# EAGLE design 004 (EAGLE 9.6.2)

## Sheet 1 of 2
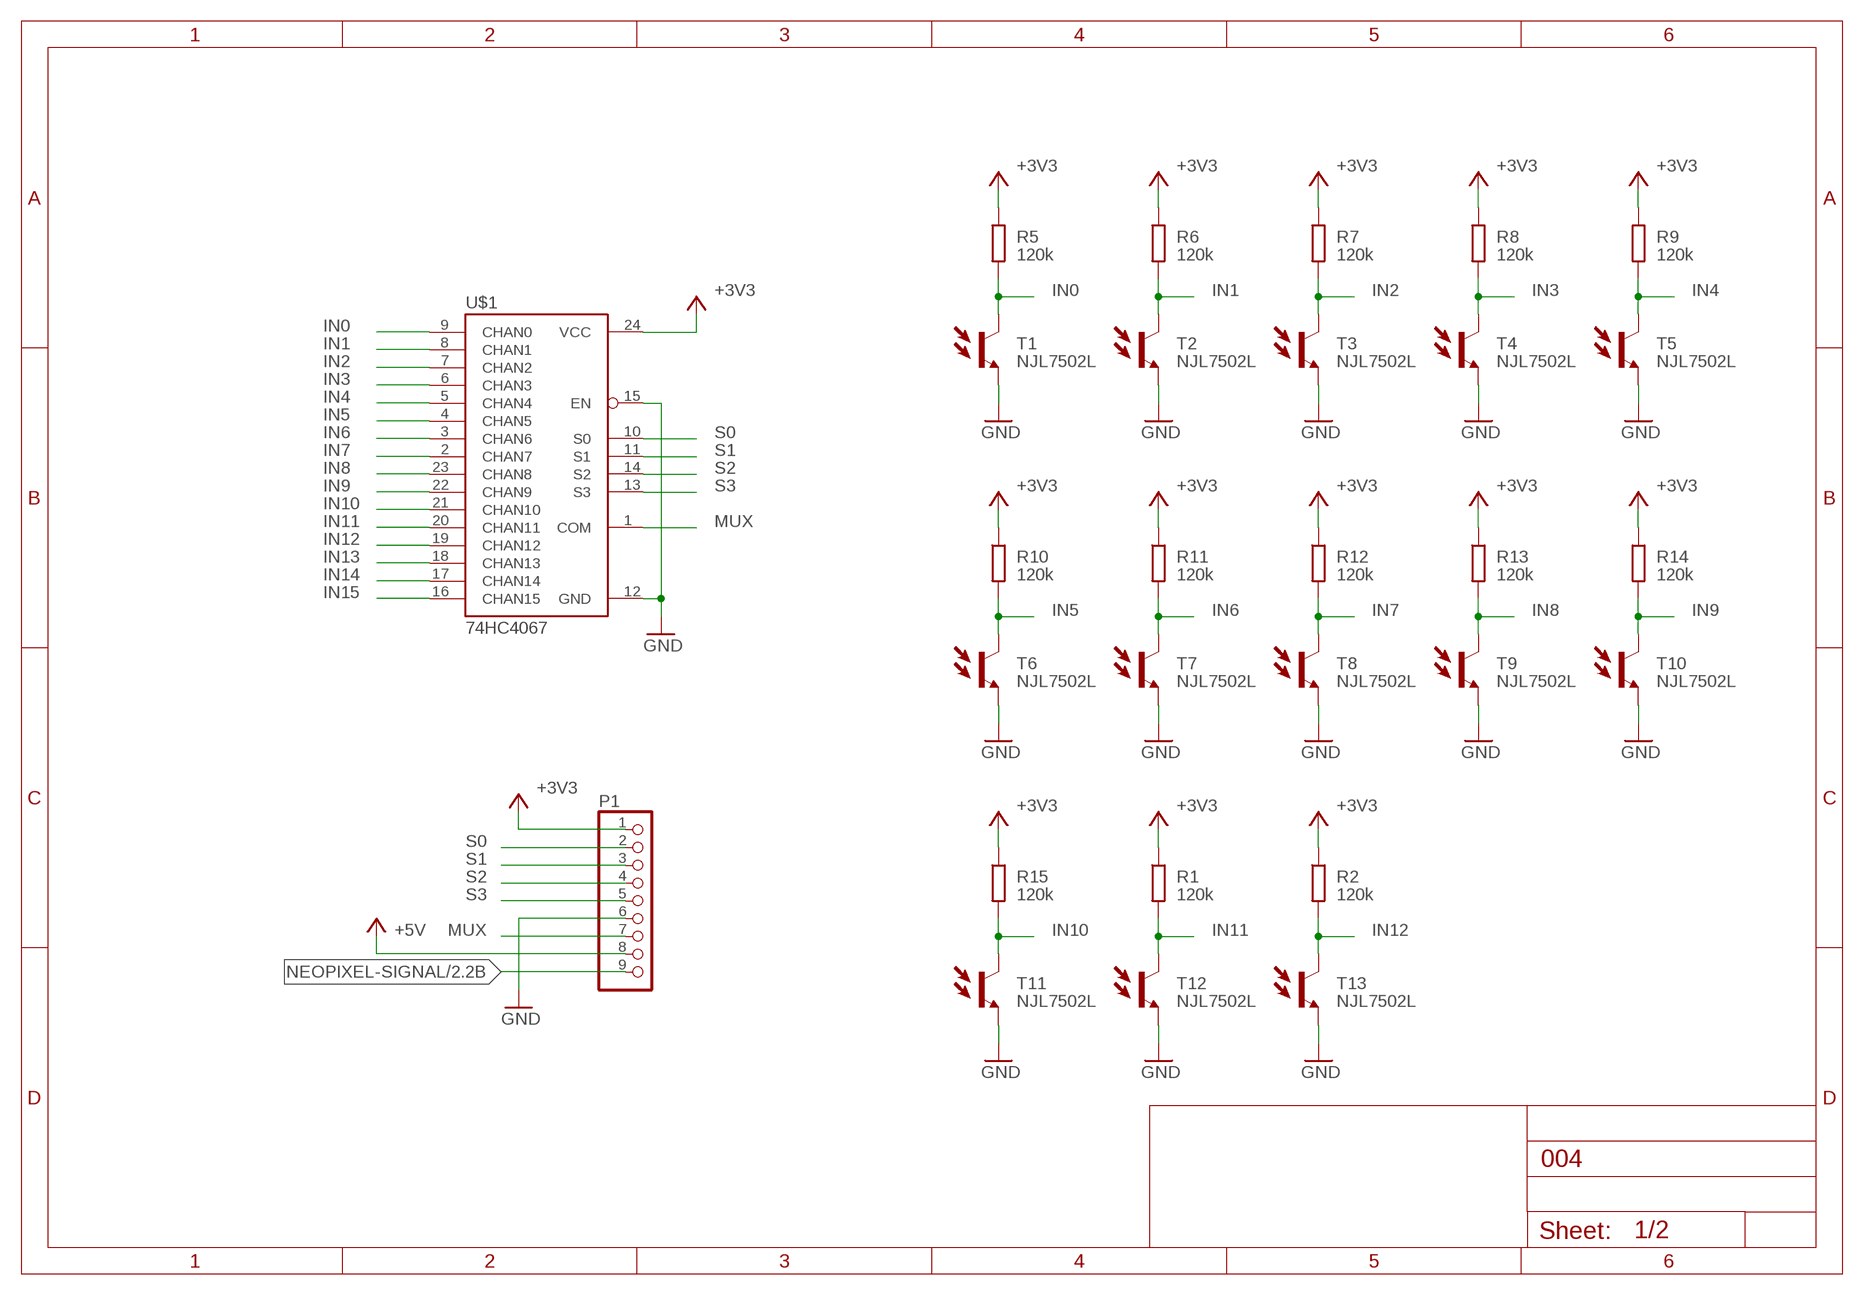
[diagram p0: schematic, sheet 1]

### Parts
P1  S9B-ZR-SM4A-TF  [ZH-SM4-SIDE09]
R1  120k  R-EU_R0805  [R0805]
R2  120k  R-EU_R0805  [R0805]
R5  120k  R-EU_R0805  [R0805]
R6  120k  R-EU_R0805  [R0805]
R7  120k  R-EU_R0805  [R0805]
R8  120k  R-EU_R0805  [R0805]
R9  120k  R-EU_R0805  [R0805]
R10  120k  R-EU_R0805  [R0805]
R11  120k  R-EU_R0805  [R0805]
R12  120k  R-EU_R0805  [R0805]
R13  120k  R-EU_R0805  [R0805]
R14  120k  R-EU_R0805  [R0805]
R15  120k  R-EU_R0805  [R0805]
T1  NJL7502L  MYPARTS_NJL7502L  [MYPARTS_NJL7502L]
T2  NJL7502L  MYPARTS_NJL7502L  [MYPARTS_NJL7502L]
T3  NJL7502L  MYPARTS_NJL7502L  [MYPARTS_NJL7502L]
T4  NJL7502L  MYPARTS_NJL7502L  [MYPARTS_NJL7502L]
T5  NJL7502L  MYPARTS_NJL7502L  [MYPARTS_NJL7502L]
T6  NJL7502L  MYPARTS_NJL7502L  [MYPARTS_NJL7502L]
T7  NJL7502L  MYPARTS_NJL7502L  [MYPARTS_NJL7502L]
T8  NJL7502L  MYPARTS_NJL7502L  [MYPARTS_NJL7502L]
T9  NJL7502L  MYPARTS_NJL7502L  [MYPARTS_NJL7502L]
T10  NJL7502L  MYPARTS_NJL7502L  [MYPARTS_NJL7502L]
T11  NJL7502L  MYPARTS_NJL7502L  [MYPARTS_NJL7502L]
T12  NJL7502L  MYPARTS_NJL7502L  [MYPARTS_NJL7502L]
T13  NJL7502L  MYPARTS_NJL7502L  [MYPARTS_NJL7502L]
U$1  74HC4067  SPARKFUN_MUX-74HC4067SMD  [SPARKFUN_SSOP24]

### Nets
+3V3: P1.1 R1.1 R2.1 R5.1 R6.1 R7.1 R8.1 R9.1 R10.1 R11.1 R12.1 R13.1 R14.1 R15.1 U$1.24(VCC)
+5V: P1.8 ; also sheet 2
GND: P1.6 T1.E T2.E T3.E T4.E T5.E T6.E T7.E T8.E T9.E T10.E T11.E T12.E T13.E U$1.12(GND) U$1.15(EN) ; also sheet 2
IN0: R5.2 T1.C U$1.9(CHAN0)
IN1: R6.2 T2.C U$1.8(CHAN1)
IN2: R7.2 T3.C U$1.7(CHAN2)
IN3: R8.2 T4.C U$1.6(CHAN3)
IN4: R9.2 T5.C U$1.5(CHAN4)
IN5: R10.2 T6.C U$1.4(CHAN5)
IN6: R11.2 T7.C U$1.3(CHAN6)
IN7: R12.2 T8.C U$1.2(CHAN7)
IN8: R13.2 T9.C U$1.23(CHAN8)
IN9: R14.2 T10.C U$1.22(CHAN9)
IN10: R15.2 T11.C U$1.21(CHAN10)
IN11: R1.2 T12.C U$1.20(CHAN11)
IN12: R2.2 T13.C U$1.19(CHAN12)
IN13: U$1.18(CHAN13)
IN14: U$1.17(CHAN14)
IN15: U$1.16(CHAN15)
MUX: P1.7 U$1.1(COM)
NEOPIXEL-SIGNAL: P1.9 ; also sheet 2
S0: P1.2 U$1.10(S0)
S1: P1.3 U$1.11(S1)
S2: P1.4 U$1.14(S2)
S3: P1.5 U$1.13(S3)

## Sheet 2 of 2: NeoPixels
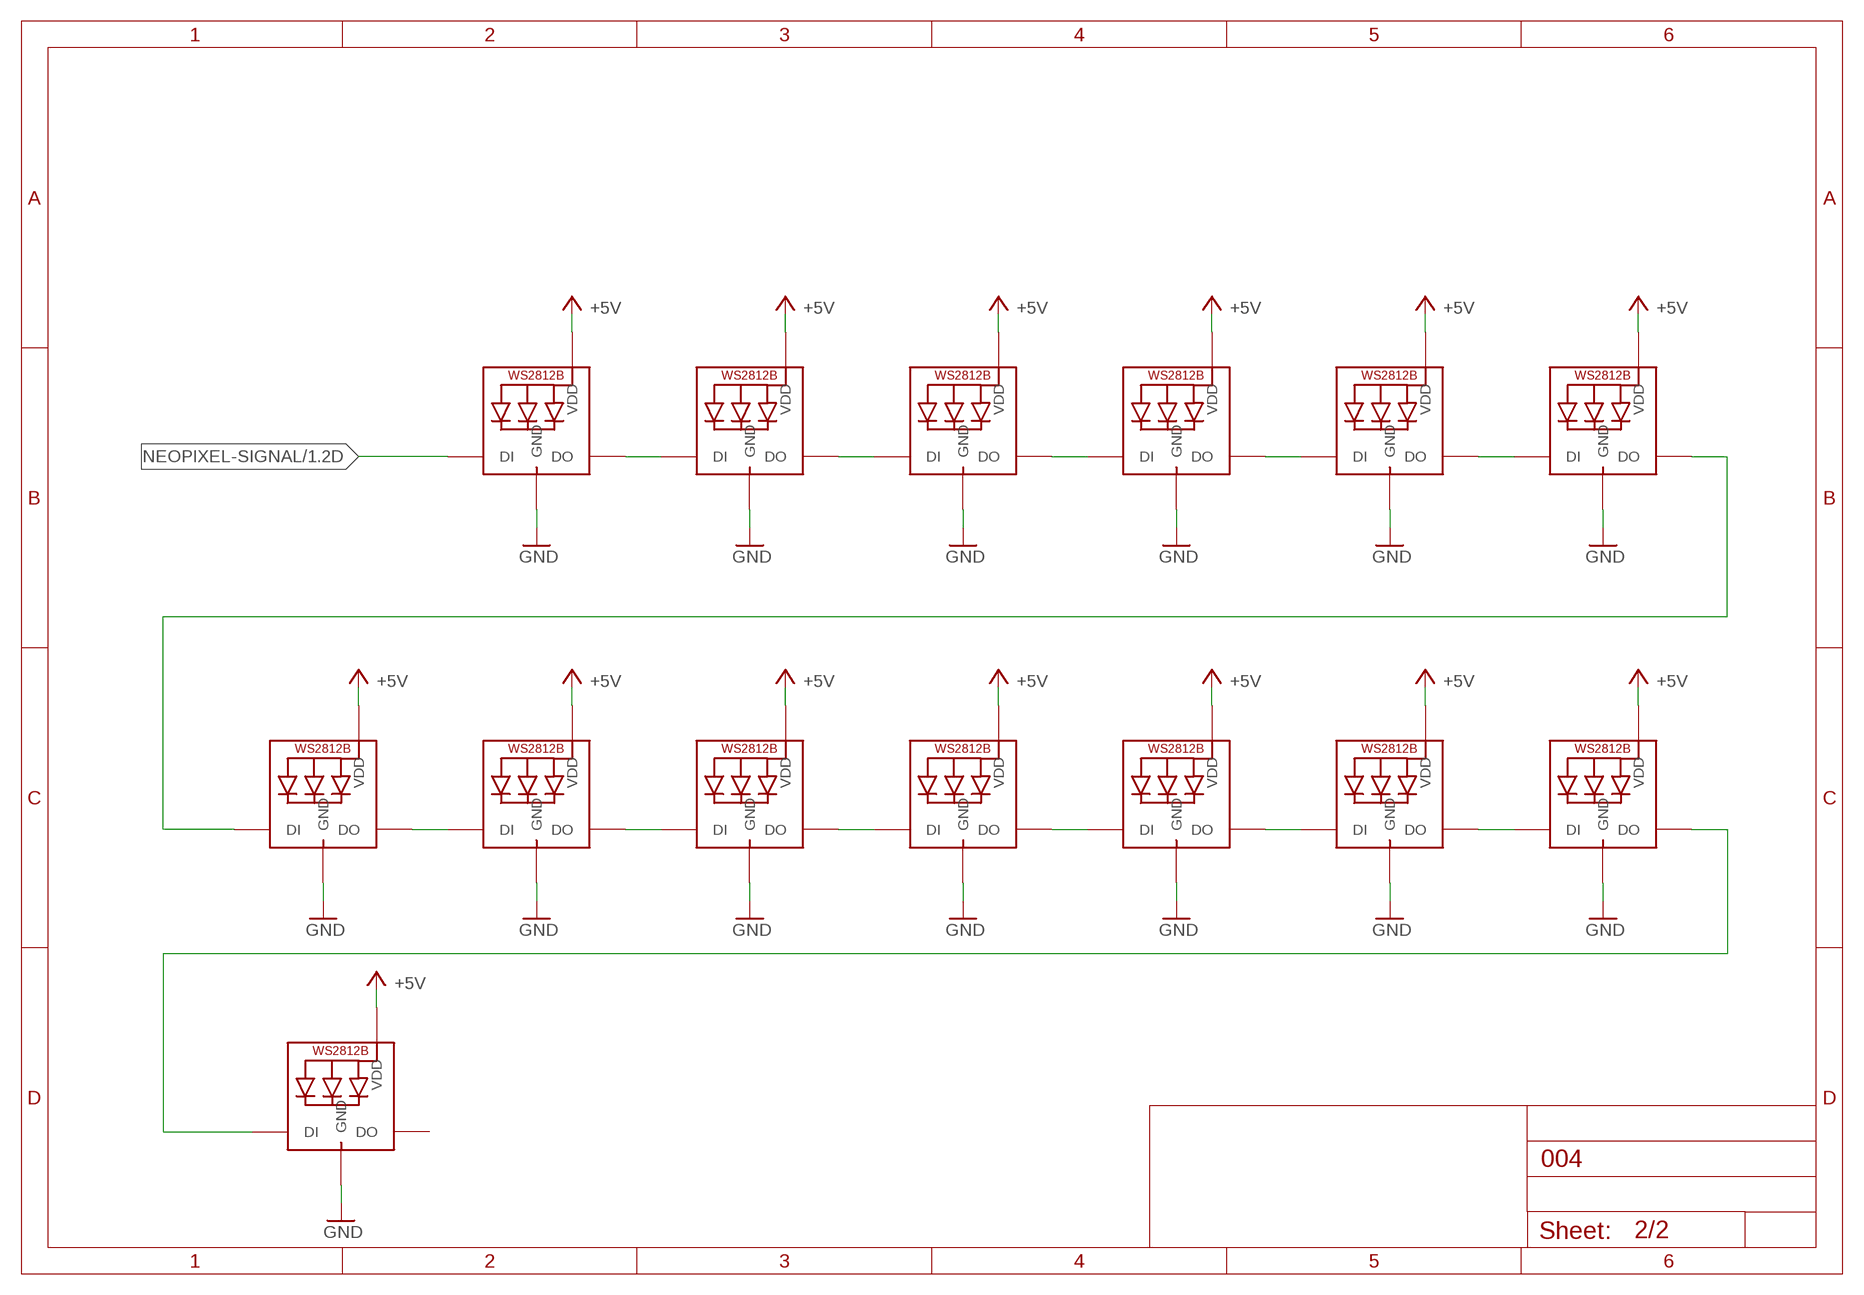
[diagram p1: schematic, sheet 2]

### Parts
LED1  WS2812B5050  [WS2812B]
LED2  WS2812B5050  [WS2812B]
LED3  WS2812B5050  [WS2812B]
LED4  WS2812B5050  [WS2812B]
LED5  WS2812B5050  [WS2812B]
LED6  WS2812B5050  [WS2812B]
LED7  WS2812B5050  [WS2812B]
LED8  WS2812B5050  [WS2812B]
LED9  WS2812B5050  [WS2812B]
LED10  WS2812B5050  [WS2812B]
LED11  WS2812B5050  [WS2812B]
LED12  WS2812B5050  [WS2812B]
LED13  WS2812B5050  [WS2812B]
LED14  WS2812B5050  [WS2812B]

### Nets
+5V: LED1.1-VDD(VDD) LED2.1-VDD(VDD) LED3.1-VDD(VDD) LED4.1-VDD(VDD) LED5.1-VDD(VDD) LED6.1-VDD(VDD) LED7.1-VDD(VDD) LED8.1-VDD(VDD) LED9.1-VDD(VDD) LED10.1-VDD(VDD) LED11.1-VDD(VDD) LED12.1-VDD(VDD) LED13.1-VDD(VDD) LED14.1-VDD(VDD) ; also sheet 1
GND: LED1.3-GND(GND) LED2.3-GND(GND) LED3.3-GND(GND) LED4.3-GND(GND) LED5.3-GND(GND) LED6.3-GND(GND) LED7.3-GND(GND) LED8.3-GND(GND) LED9.3-GND(GND) LED10.3-GND(GND) LED11.3-GND(GND) LED12.3-GND(GND) LED13.3-GND(GND) LED14.3-GND(GND) ; also sheet 1
N$1: LED2.2-DOUT(DO) LED3.4-DIN(DI)
N$2: LED1.2-DOUT(DO) LED2.4-DIN(DI)
N$3: LED3.2-DOUT(DO) LED4.4-DIN(DI)
N$4: LED4.2-DOUT(DO) LED5.4-DIN(DI)
N$5: LED5.2-DOUT(DO) LED6.4-DIN(DI)
N$6: LED6.2-DOUT(DO) LED7.4-DIN(DI)
N$7: LED7.2-DOUT(DO) LED8.4-DIN(DI)
N$8: LED8.2-DOUT(DO) LED9.4-DIN(DI)
N$9: LED9.2-DOUT(DO) LED10.4-DIN(DI)
N$10: LED10.2-DOUT(DO) LED11.4-DIN(DI)
N$11: LED11.2-DOUT(DO) LED12.4-DIN(DI)
N$12: LED12.2-DOUT(DO) LED13.4-DIN(DI)
N$13: LED13.2-DOUT(DO) LED14.4-DIN(DI)
NEOPIXEL-SIGNAL: LED1.4-DIN(DI) ; also sheet 1
Unconnected: LED14.2-DOUT(DO)

## Library data of the parts
LED1-LED14 = microbuilder:WS2812B
P1 = zh:S9B-ZR-SM4A-TF
R1 R2 R5-R15 = rcl:R-EU_: RESISTOR, European symbol; SPICEPREFIX: R
T1-T13 = #001-line:MYPARTS_NJL7502L
U$1 = Analog-Digital-Mux-Breakout:SPARKFUN_MUX-74HC4067

## Net classes
0 default: width 0.178 mm

## Board
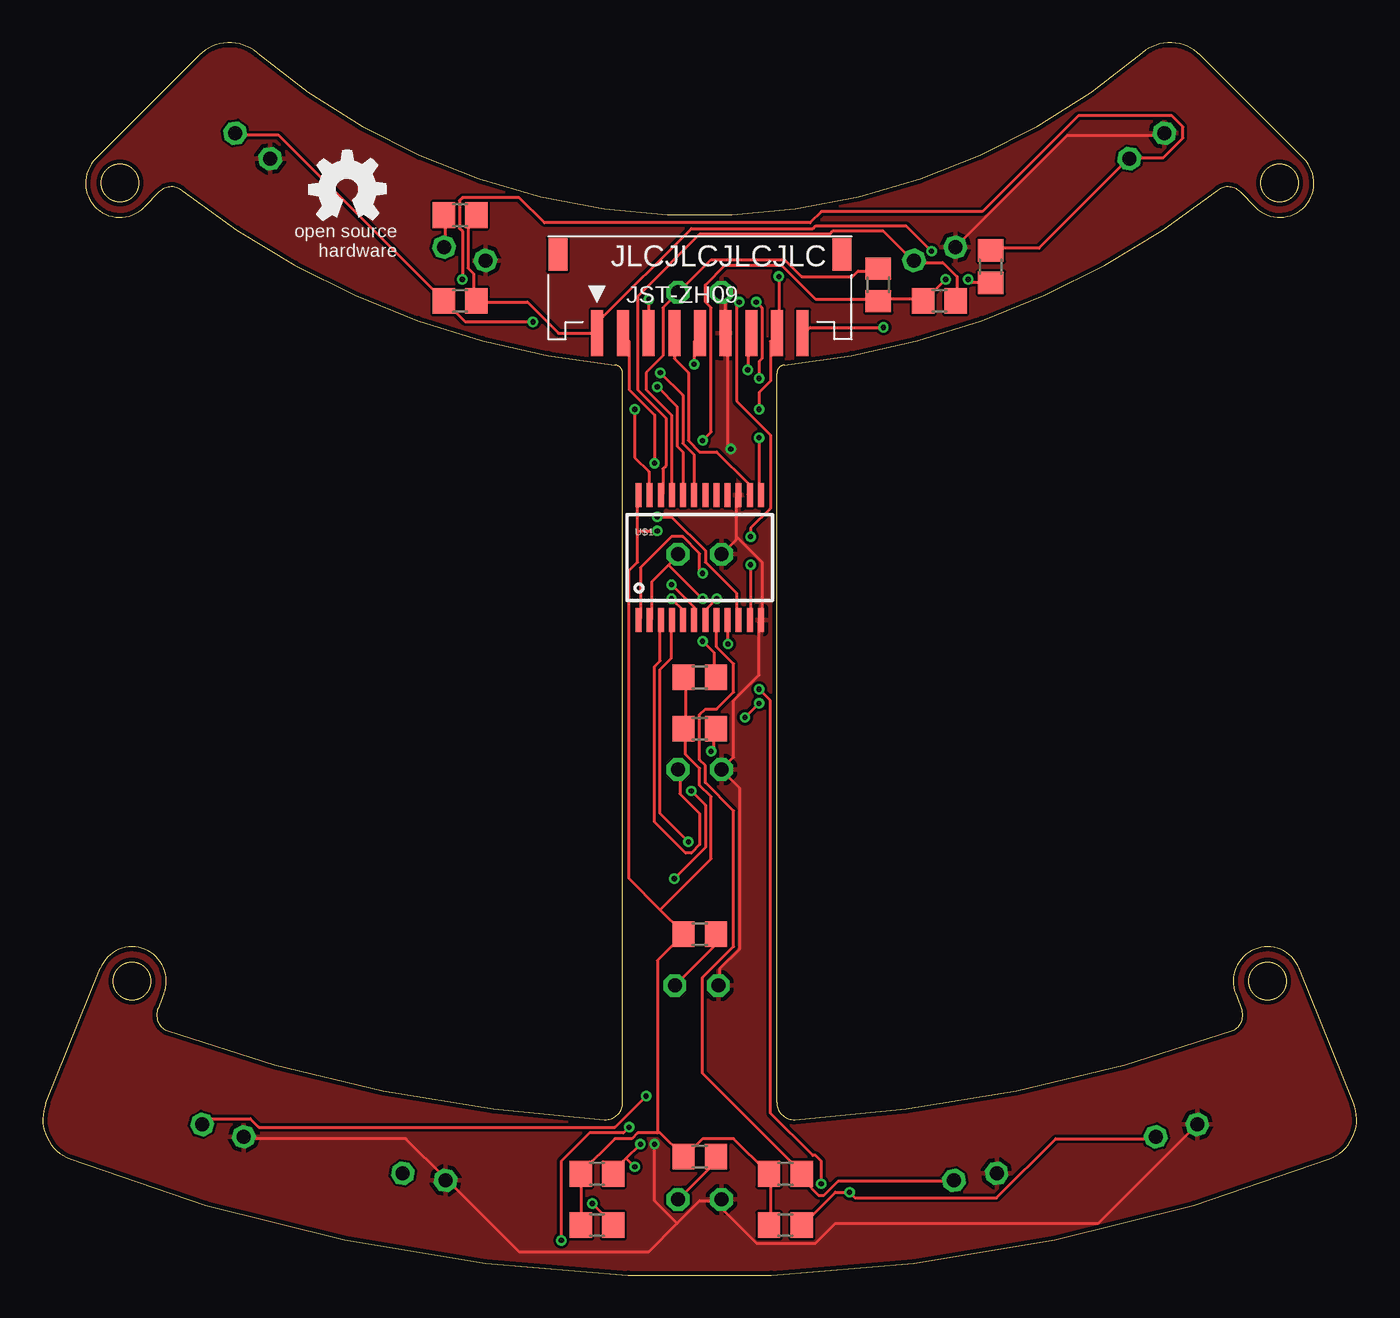
[diagram p2: board, top side]
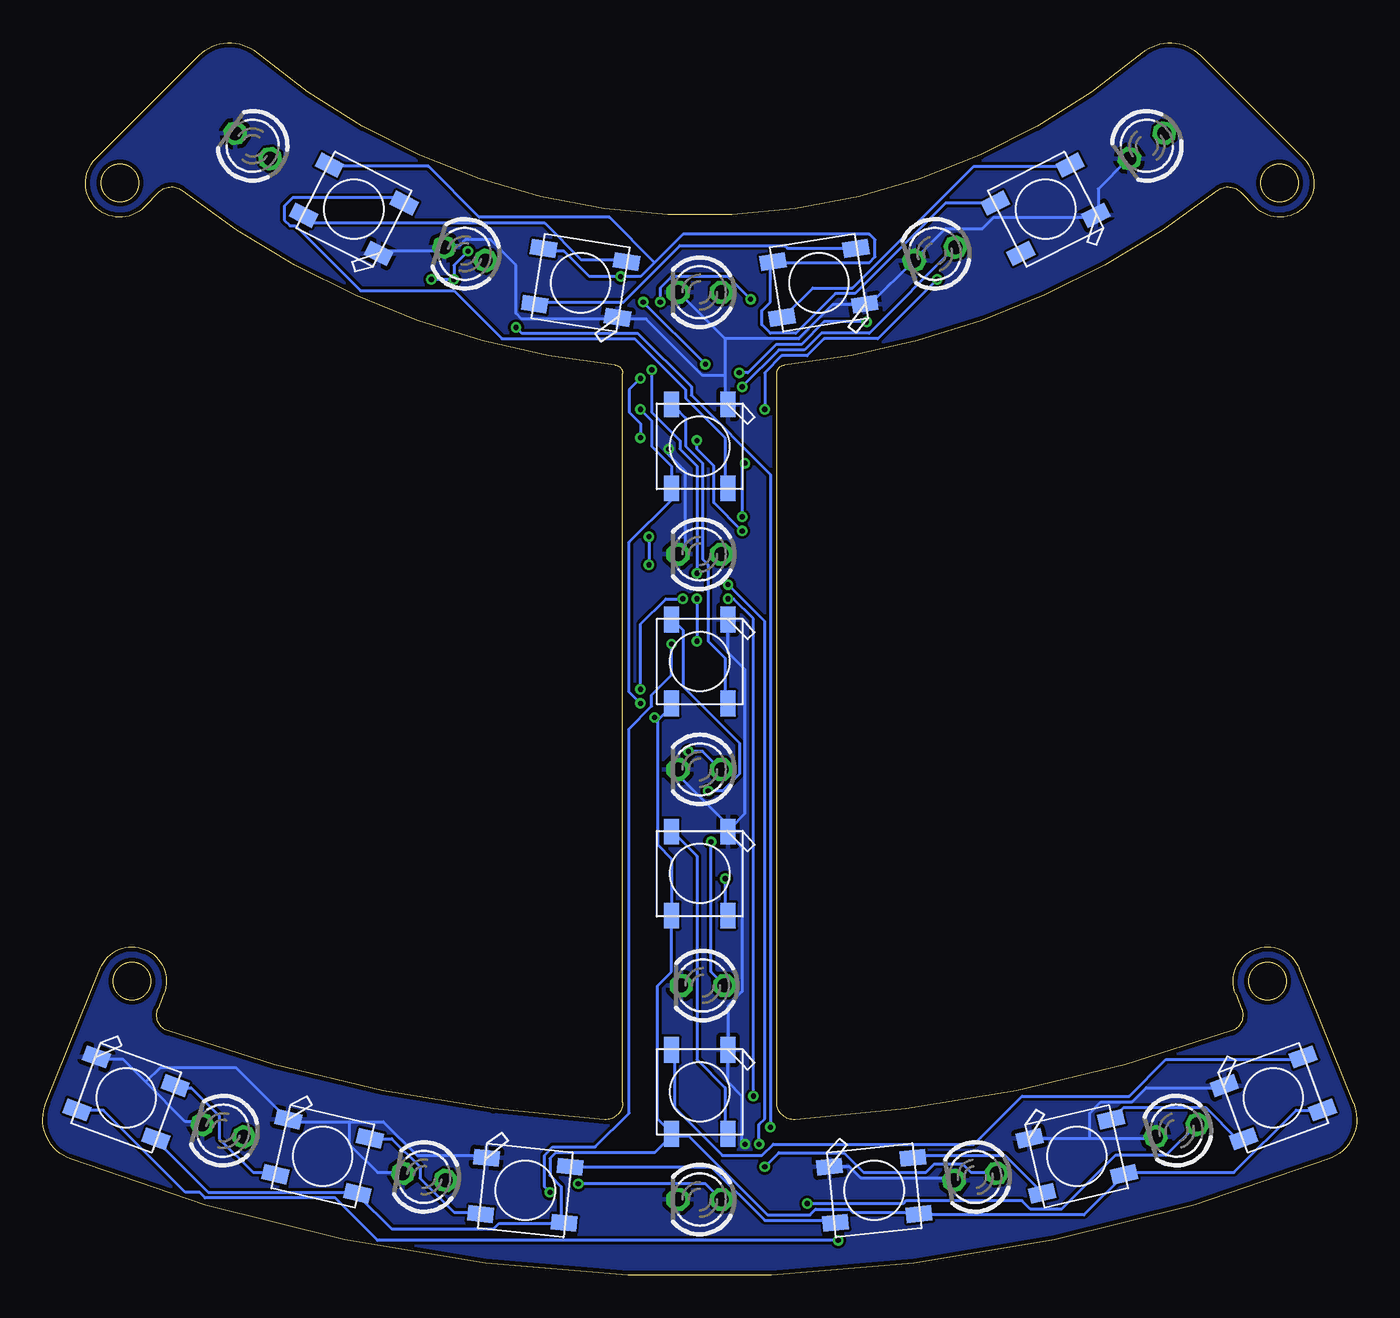
[diagram p3: board, bottom side, seen from below]

Size 76.76 x 71.99 mm. Coordinates in mm from the lower left corner, seen from the top.
Outline: 12.52,71.4 arc81 64.24,71.4
Outline: 12.52,71.4 arc85 9.14,71.26
Outline: 3.09,65.21 arc180 5.91,62.38
Outline: 8.14,63.36 arc83 6.81,63.28
Outline: 8.14,63.36 arc32 33.43,53.17
Outline: 33.88,52.67 arc84 33.43,53.17
Outline: 32.82,9.08 arc93 33.88,10.08
Outline: 7.32,14.25 arc16 32.82,9.08
Outline: 6.73,15.57 arc92 7.32,14.25
Outline: 7.07,16.42 arc180 3.36,17.92
Outline: 0.18,10.04 arc91 1.6,6.78
Outline: 1.6,6.78 arc42 75.16,6.78
Outline: 75.16,6.78 arc91 76.57,10.04
Outline: 73.39,17.92 arc180 69.68,16.42
Outline: 69.43,14.25 arc92 70.03,15.57
Outline: 43.94,9.08 arc16 69.43,14.25
Outline: 42.88,10.08 arc93 43.94,9.08
Outline: 43.33,53.17 arc84 42.88,52.67
Outline: 43.33,53.17 arc32 68.62,63.36
Outline: 69.94,63.28 arc83 68.62,63.36
Outline: 70.84,62.38 arc180 73.67,65.21
Outline: 67.62,71.26 arc85 64.24,71.4
Outline: 67.62,71.26 arc85 64.24,71.4
Outline: 73.67,65.21 67.62,71.26
Outline: 43.33,53.17 arc32 68.62,63.36
Outline: 43.33,53.17 arc84 42.88,52.67
Outline: 42.88,10.08 42.88,52.67
Outline: 76.57,10.04 73.39,17.92
Outline: 75.16,6.78 arc91 76.57,10.04
Outline: 73.39,17.92 arc180 69.68,16.42
Outline: 70.84,62.38 arc180 73.67,65.21
Outline: 69.94,63.28 70.84,62.38
Outline: 69.94,63.28 arc83 68.62,63.36
Outline: 43.94,9.08 arc16 69.43,14.25
Outline: 42.88,10.08 arc93 43.94,9.08
Outline: 69.68,16.42 70.03,15.57
Outline: 69.43,14.25 arc92 70.03,15.57
Outline: 1.6,6.78 arc42 75.16,6.78
Outline: 0.18,10.04 arc91 1.6,6.78
Outline: 0.18,10.04 3.36,17.92
Outline: 7.07,16.42 arc180 3.36,17.92
Outline: 7.07,16.42 6.73,15.57
Outline: 6.73,15.57 arc92 7.32,14.25
Outline: 7.32,14.25 arc16 32.82,9.08
Outline: 32.82,9.08 arc93 33.88,10.08
Outline: 33.88,10.08 33.88,52.67
Outline: 33.88,52.67 arc84 33.43,53.17
Outline: 8.14,63.36 arc32 33.43,53.17
Outline: 8.14,63.36 arc83 6.81,63.28
Outline: 6.81,63.28 5.91,62.38
Outline: 3.09,65.21 arc180 5.91,62.38
Outline: 3.09,65.21 9.14,71.26
Outline: 12.52,71.4 arc85 9.14,71.26
Outline: 12.52,71.4 arc81 64.24,71.4
Outline: circle at 72.26,63.79 radius 1.1
Outline: circle at 71.54,17.17 radius 1.1
Outline: circle at 5.22,17.17 radius 1.1
Outline: circle at 4.5,63.79 radius 1.1
Outline: circle at 71.54,17.17 radius 1.1
Outline: circle at 72.26,63.79 radius 1.1
Outline: circle at 4.5,63.79 radius 1.1
Outline: circle at 5.22,17.17 radius 1.1
Copper layers (1*16): Top 0.035mm / dielectric 1.5mm / Bottom 0.035mm
Design rules "SeeedStudio_2layer_DRU_no_angle_20140221": minimum track width 6mil, minimum drill 12mil, track to track 6mil, track to pad 6mil, pad to pad 6mil, via to via 6mil, smd to smd 0mil, copper to edge 10mil, drill to drill 10mil, minimum pad ring 10mil, minimum via ring 6mil, stop-mask expansion 2mil, vias tented up to drill 100mil, thermal gap 10mil

### Footprints (pad centres in the part's own frame; a part is rotated, then mirrored left to right if it is on the bottom)
WS2812B = smd 1.5 x 0.9: 1-VDD 2.45,-1.65; 2-DOUT 2.45,1.65; 3-GND -2.45,1.65; 4-DIN -2.45,-1.65
ZH-SM4-SIDE09 = smd 0.7 x 2.7: 1 -14.85,-5.65; 2 -13.35,-5.65; 3 -11.85,-5.65; 4 -10.35,-5.65; 5 -8.85,-5.65; 6 -7.35,-5.65; 7 -5.85,-5.65; 8 -4.35,-5.65; 9 -2.85,-5.65 | smd 1.1 x 1.9: P$1 -0.55,-1.05; P$2 -17.15,-1.05
R0805 = smd 1.3 x 1.5: 1 -0.95,0; 2 0.95,0
MYPARTS_NJL7502L = drill 0.813 octagon: C -1.27,0; E 1.27,0
SPARKFUN_SSOP24 = smd 0.348 x 1.397: 1 -3.575,-3.656; 2 -2.925,-3.656; 3 -2.275,-3.656; 4 -1.625,-3.656; 5 -0.975,-3.656; 6 -0.325,-3.656; 7 0.325,-3.656; 8 0.975,-3.656; 9 1.625,-3.656; 10 2.275,-3.656; 11 2.925,-3.656; 12 3.575,-3.656; 13 3.575,3.656; 14 2.925,3.656; 15 2.275,3.656; 16 1.625,3.656; 17 0.975,3.656; 18 0.325,3.656; 19 -0.325,3.656; 20 -0.975,3.656; 21 -1.625,3.656; 22 -2.275,3.656; 23 -2.925,3.656; 24 -3.575,3.656

### Placement (x,y rotation side)
LED1  71.89,10.35 339.9 bottom
LED2  60.4,6.93 346.9 bottom
LED3  48.57,4.95 354 bottom
LED4  28.19,4.95 6 bottom
LED5  16.36,6.93 13.1 bottom
LED6  4.87,10.35 20.1 bottom
LED7  38.38,10.7 270 bottom
LED8  38.38,23.45 270 bottom
LED9  38.38,35.84 270 bottom
LED10  38.38,48.41 270 bottom
LED11  58.58,62.26 153 bottom
LED12  45.34,57.96 171 bottom
LED13  31.42,57.96 189 bottom
LED14  18.18,62.26 207 bottom
P1  47.24,60.67 0 top
R1  24.38,61.91 180 top
R2  24.38,56.91 180 top
R5  43.38,2.91 0 top
R6  43.38,5.91 0 top
R7  38.38,6.91 0 top
R8  32.38,5.91 0 top
R9  32.38,2.91 0 top
R10  38.38,19.91 0 top
R11  38.38,31.91 0 top
R12  38.38,34.91 0 top
R13  55.38,58.91 90 top
R14  52.38,56.91 0 top
R15  48.81,57.84 90 top
T1  66.23,8.44 163.4 bottom
T2  54.47,5.73 170.5 bottom
T3  38.38,4.41 180 bottom
T4  22.28,5.73 189.5 bottom
T5  10.53,8.44 196.6 bottom
T6  38.2,16.91 180 bottom
T7  38.38,29.54 180 bottom
T8  38.38,42.11 180 bottom
T9  64.5,65.97 144 bottom
T10  52.11,59.66 162 bottom
T11  38.38,57.41 180 bottom
T12  24.65,59.66 198 bottom
T13  12.26,65.97 216 bottom
U$1  38.38,41.91 0 top
U$2  [OSHW_5MM]  17.78,63.41 0 top

### Tracks (layer width: path | path; a pad name or v marks a point on that pad's centre or on a via)
+3V3  (via drill 0.3)
  Top 0.178: v54.06,58.16 54.23,58 55.22,58 R13.1 | v52.74,58.16 51.59,57.01 R14.1 51.42,57.01 48.94,57.01 R15.1 48.78,57.01 45.15,57.01 43.17,58.99 39.86,58.99 38.71,57.83 38.71,56.84 39.04,56.51 39.04,49.25 v38.54,48.75 | R1.1 25.17,61.8 24.84,61.46 24.84,58.82 25.17,58.49 25.17,57.01 R2.1 25.34,56.84 28.31,56.84 30.12,55.03 32.27,55.03 P1.1 32.43,55.03 32.43,55.69 37.88,61.13 44.98,61.13 45.15,61.3 50.43,61.3 v51.92,59.81 | R9.1 31.44,3.02 31.44,5.83 R8.1 31.44,5.99 33.43,7.97 34.42,7.97 34.75,8.3 35.9,8.3 | R5.1 42.51,3.02 42.51,5.83 R6.1 42.34,5.99 40.36,7.97 38.54,7.97 37.55,6.98 R7.1 37.39,6.98 36.07,8.3 35.9,8.3 | R12.1 37.55,34.88 37.55,32.08 R11.1 37.55,31.91 37.55,30.43 38.38,29.6 38.38,28.61 39.04,27.95 39.04,24.32 36.07,21.35 | 34.75,43.47 34.75,41.65 34.25,41.16 34.25,23.16 36.07,21.35 | 34.75,43.47 34.75,45.45 U$1.24 | 36.07,21.35 37.39,20.02 R10.1 37.39,19.86 35.9,18.37 35.9,8.3 | 34.75,43.47 v35.9,43.47
  Bottom 0.178: v54.06,58.16 v52.74,58.16 52.74,58.99 v51.92,59.81 | v38.54,48.75 38.54,48.26 37.55,47.27 37.55,45.12 v35.9,43.47
+5V  (via drill 0.3)
  Top 0.178: v41.85,50.57 41.85,51.56 42.51,52.22 42.51,54.53 42.84,54.86 P1.8 43,55.03 v43,58.33 | v41.02,32.57 v41.85,33.4
  Bottom 0.178: v41.85,50.57 41.19,49.91 41.19,48.42 40.03,47.27 40.03,46.11 LED10.1-VDD 40.03,45.95 40.03,45.29 42.51,42.81 42.51,34.06 v41.85,33.4 | LED14.1-VDD 21.21,62.62 24.01,62.62 29.3,57.34 30.45,57.34 32.77,55.03 34.25,55.03 34.75,55.52 34.75,56.35 34.25,56.84 34.25,59.15 LED13.1-VDD 34.09,59.15 28.47,59.15 28.14,59.48 28.14,60.47 28.47,60.8 39.37,60.8 41.02,59.15 | 41.02,59.15 41.85,58.33 v43,58.33 44.82,58.33 46.3,59.81 47.46,59.81 LED12.1-VDD | 41.02,59.15 43.66,61.8 51.26,61.8 54.23,64.77 60.01,64.77 LED11.1-VDD | LED6.1-VDD 2.06,9.62 3.54,9.62 7.17,5.99 13.45,5.99 LED5.1-VDD 13.61,5.83 15.92,3.51 25.5,3.51 LED4.1-VDD 25.67,3.68 29.46,3.68 29.63,3.85 31.61,3.85 31.94,3.51 34.42,3.51 39.04,8.14 39.86,8.14 LED7.1-VDD | 40.86,32.41 40.86,25.14 40.03,24.32 LED8.1-VDD 40.03,20.85 40.03,17.71 40.86,16.89 40.86,9.13 40.03,8.3 LED7.1-VDD | 40.86,32.41 40.03,33.23 LED9.1-VDD | LED7.1-VDD 40.03,8.14 41.02,7.15 46.8,7.15 47.13,6.82 47.13,5.83 46.47,5.17 46.47,3.18 LED3.1-VDD 46.47,3.02 50.1,3.02 50.43,2.69 56.37,2.69 58.36,4.67 LED2.1-VDD 58.52,4.84 67.11,4.84 70.08,7.81 LED1.1-VDD | 40.86,32.41 v41.02,32.57
GND  (via drill 0.3)
  Top 0.178: T9.E 65.45,66.58 59.84,66.58 53.4,60.14 T10.E | T11.E 39.7,57.34 39.86,57.17 39.86,55.03 P1.6 40.03,54.86 40.03,48.42 v40.19,48.26 | 40.52,43.14 40.52,42.97 39.7,42.15 T8.E | 40.52,43.14 40.52,45.45 U$1.15 | 40.52,43.14 42.01,41.65 42.01,38.35 U$1.12 41.85,38.19 41.85,35.05 40.36,33.56 40.36,30.26 39.7,29.6 T7.E 39.7,29.44 40.69,28.45 40.69,19.03 39.53,17.88 39.53,17.05 T6.E | 37.06,3.02 35.41,1.37 27.81,1.37 23.68,5.5 T4.E 23.52,5.66 21.21,7.97 11.8,7.97 T5.E | 37.06,3.02 38.38,4.34 39.53,4.34 T3.E 39.7,4.34 39.7,3.85 41.68,1.86 45.15,1.86 46.3,3.02 61.66,3.02 67.44,8.8 T1.E | v35.74,7.64 35.74,4.34 37.06,3.02
  Bottom 0.178: LED11.3-GND 57.03,59.81 53.57,59.81 53.4,59.98 T10.E 53.24,60.14 52.41,60.14 52.08,60.47 50.6,60.47 49.11,58.99 49.11,56.18 48.78,55.85 43.33,55.85 LED12.3-GND 43.17,55.85 41.52,55.85 38.21,52.55 36.89,52.55 | 36.89,54.7 36.89,52.55 | 36.89,52.55 36.89,50.9 LED10.3-GND | 36.89,54.7 39.53,57.34 T11.E | T13.E 13.45,65.1 15.1,63.45 15.1,61.96 LED14.3-GND 15.26,61.8 21.21,61.8 21.87,61.13 24.01,61.13 25.83,59.32 T12.E 26,59.15 28.31,56.84 28.64,56.84 LED13.3-GND 28.8,56.68 30.62,56.68 32.6,54.7 36.89,54.7 | LED8.3-GND 36.73,25.8 35.9,24.98 35.9,16.56 36.73,15.73 36.73,13.26 LED7.3-GND 36.73,13.09 36.73,11.27 35.9,10.45 35.9,7.81 v35.74,7.64 | 36.56,26.13 36.73,25.97 LED8.3-GND | 36.56,26.13 35.74,26.96 35.74,35.38 36.73,36.37 36.73,38.19 LED9.3-GND | 36.56,26.13 39.53,29.11 39.53,29.44 T7.E | 36.56,26.13 LED8.3-GND | 70.74,11.27 68.43,8.96 67.6,8.96 T1.E | 70.74,11.27 72.06,12.6 73.54,12.6 LED1.3-GND | 58.85,8.96 62.32,8.96 LED2.3-GND 62.48,9.13 65.45,12.1 69.91,12.1 70.74,11.27 | 58.85,8.96 56.87,8.96 54.89,6.98 50.93,6.98 LED3.3-GND | 58.85,8.96 58.85,7.64 57.2,5.99 55.88,5.99 T2.E | 15.59,7.97 11.8,7.97 T5.E | 15.59,7.97 19.06,7.97 LED5.3-GND | 15.59,7.97 15.59,9.46 14.93,10.12 13.12,10.12 12.29,10.94 7.83,10.94 LED6.3-GND | LED4.3-GND 30.78,6.32 29.63,6.32 28.97,5.66 23.68,5.66 T4.E | v40.19,48.26 40.19,47.93 39.2,46.94 39.2,42.48 39.53,42.15 T8.E
  pour Top: -0.62,-1.09 77.38,-1.09 77.38,72.91 -0.62,72.91
  pour Bottom: 77.38,72.91 77.38,-1.09 -0.62,-1.09 -0.62,72.91
IN0  (via drill 0.3)
  Top 0.178: v40.03,36.87 40.03,38.19 U$1.9 | R5.2 44.49,3.02 46.3,4.84 v47.13,4.84 47.46,4.51 55.71,4.51 59.18,7.97 64.96,7.97 T1.C
  Bottom 0.178: v40.03,36.87 40.03,35.05 41.19,33.89 41.19,33.23 42.51,31.91 42.51,9.46 44.49,7.48 46.96,7.48 47.46,6.98 47.46,5.17 v47.13,4.84
IN1
  Top 0.178: U$1.8 39.37,38.19 39.37,36.7 40.36,35.71 40.36,34.06 39.37,33.07 38.71,33.07 38.38,32.74 38.38,30.1 38.71,29.77 38.71,28.78 40.36,27.12 40.36,19.2 38.54,17.38 38.54,11.77 44.32,5.99 R6.2 44.49,5.83 44.49,5.5 45.31,4.67 45.64,4.67 46.47,5.5 53.07,5.5 T2.C
IN2  (via drill 0.3)
  Top 0.178: v39.37,39.51 38.71,38.85 38.71,38.35 U$1.7 | v41.85,34.22 42.51,33.56 42.51,9.46 44.98,6.98 45.15,6.98 45.48,6.65 v45.48,5.33 | R7.2 39.2,6.82 39.2,6.49 37.22,4.51 T3.C
  Bottom 0.178: v39.37,39.51 40.36,39.51 41.85,38.02 v41.85,34.22 | v45.48,5.33 38.05,5.33 37.22,4.51 T3.C
IN3  (via drill 0.3)
  Top 0.178: v36.73,40.33 38.05,39.01 38.05,38.35 U$1.6 | 34.09,6.82 33.26,5.99 R8.2 | 34.09,6.82 v34.91,7.64 | 34.09,6.82 v34.58,6.32
  Bottom 0.178: v36.73,40.33 34.58,38.19 34.58,9.13 34.91,8.8 v34.91,7.64 | v34.58,6.32 33.76,7.15 29.96,7.15 28.8,5.99 25.17,5.99 24.68,6.49 23.02,6.49 22.53,5.99 21.04,5.99 T4.C
IN4  (via drill 0.3)
  Top 0.178: v36.73,39.51 37.39,38.85 37.39,38.35 U$1.5 | v35.24,10.45 33.43,8.63 12.62,8.63 12.13,9.13 9.49,9.13 9.32,8.96 T5.C | v32.1,4.18 33.26,3.02 R9.2
  Bottom 0.178: v36.73,39.51 36.4,39.51 35.24,38.35 v35.24,10.45 | v32.1,4.18 26.49,4.18 26.33,4.34 19.56,4.34 19.06,3.85 17.25,3.85 14.11,6.98 11.14,6.98 9.32,8.8 T5.C
IN5  (via drill 0.3)
  Top 0.178: v37.72,25.31 36.07,26.96 36.07,35.38 36.73,36.04 36.73,38.19 U$1.4 | R10.2 39.2,19.86 39.2,19.2 37.06,17.05 T6.C
  Bottom 0.178: v37.72,25.31 37.72,17.71 37.06,17.05 T6.C
IN6  (via drill 0.3)
  Top 0.178: U$1.3 36.07,38.19 36.07,35.87 35.74,35.54 35.74,26.46 37.55,24.65 37.88,24.65 38.38,25.14 38.38,26.96 37.22,28.11 37.22,29.44 T7.C | v39.04,30.59 39.2,30.76 39.2,31.91 R11.2
  Bottom 0.178: v39.04,30.59 38.21,30.59 37.22,29.6 T7.C
IN7  (via drill 0.3)
  Top 0.178: 36.56,41.49 37.06,41.98 T8.C | 36.56,41.49 35.57,40.5 35.57,38.35 U$1.2 | v38.54,37.03 39.2,36.37 39.2,35.05 R12.2 | 36.56,41.49 v38.54,39.51
  Bottom 0.178: v38.54,39.51 v38.54,37.03
IN8  (via drill 0.3)
  Top 0.178: v34.58,50.57 34.58,47.76 35.41,46.94 35.41,45.62 U$1.23 | v24.51,58.16 24.51,60.97 24.34,61.13 24.34,62.79 24.51,62.95 27.81,62.95 29.3,61.46 44.82,61.46 45.48,62.13 54.89,62.13 60.5,67.74 65.95,67.74 66.61,67.08 66.61,66.42 65.45,65.26 63.47,65.26 T9.C 63.31,65.1 58.19,59.98 55.38,59.98 R13.2
  Bottom 0.178: v34.58,50.57 34.58,52.71 33.59,53.71 32.1,53.71 31.11,54.7 27.98,54.7 v24.51,58.16
IN9
  Top 0.178: U$1.22 36.23,45.62 36.23,47.1 36.4,47.27 36.4,50.07 34.75,51.72 34.75,57.17 38.38,60.8 45.97,60.8 46.14,60.97 49.11,60.97 50.76,59.32 T10.C 50.93,59.15 52.58,59.15 53.4,58.33 53.4,57.01 R14.2
IN10
  Top 0.178: U$1.21 36.73,45.62 36.73,50.24 35.24,51.72 35.24,52.71 36.23,53.71 36.23,56.51 37.06,57.34 T11.C 37.22,57.5 39.04,59.32 43.33,59.32 44.32,58.33 47.29,58.33 47.62,58.66 48.78,58.66 R15.2
IN11  (via drill 0.3)
  Top 0.178: v35.9,51.89 37.06,50.73 37.06,48.42 37.39,48.09 37.39,45.62 U$1.20 | R1.2 23.52,61.8 23.52,60.14 T12.C
  Bottom 0.178: v35.9,51.89 33.76,54.04 32.27,54.04 31.28,55.03 28.47,55.03 23.52,59.98 T12.C
IN12  (via drill 0.3)
  Top 0.178: v36.07,52.71 37.39,51.39 37.39,48.59 38.05,47.93 38.05,45.62 U$1.19 | v28.64,55.69 24.68,55.69 23.52,56.84 R2.2 23.35,57.01 13.78,66.58 11.3,66.58 T13.C
  Bottom 0.178: v36.07,52.71 35.57,52.71 33.92,54.37 32.43,54.37 31.11,55.69 v28.64,55.69
MUX  (via drill 0.3)
  Top 0.178: v38.54,40.99 38.38,41.16 38.38,42.15 37.39,43.14 36.73,43.14 34.91,41.32 34.91,38.35 U$1.1 | v41.19,52.88 41.19,54.7 41.35,54.86 P1.7
  Bottom 0.178: v38.54,40.99 38.54,47.27 39.53,48.26 39.53,48.75 41.19,50.4 v41.19,52.88
N$1
  Bottom 0.178: LED3.4-DIN 51.26,3.68 52.74,3.68 54.72,5.66 54.72,6.32 56.37,7.97 57.53,7.97 LED2.2-DOUT
N$2
  Bottom 0.178: LED2.4-DIN 63.31,5.99 64.46,5.99 66.45,7.97 66.45,9.29 68.1,10.94 68.92,10.94 LED1.2-DOUT
N$3
  Bottom 0.178: LED4.4-DIN 30.45,3.18 34.58,3.18 37.72,6.32 45.81,6.32 LED3.2-DOUT
N$4
  Bottom 0.178: LED5.4-DIN 18.4,4.84 20.55,6.98 25.83,6.98 LED4.2-DOUT
N$5
  Bottom 0.178: LED6.4-DIN 6.68,7.97 7.01,7.97 8.83,9.79 13.61,9.79 14.27,9.13 LED5.2-DOUT
N$6
  Bottom 0.178: LED6.2-DOUT 3.21,12.6 11.14,12.6 13.28,10.45 19.56,10.45 22.36,7.64 34.09,7.64 34.75,6.98 37.06,6.98 39.86,9.79 39.86,13.09 LED7.4-DIN
N$7
  Bottom 0.178: LED7.2-DOUT 36.89,8.3 36.89,10.94 38.54,12.6 38.54,24.48 39.86,25.8 LED8.4-DIN
N$8  (via drill 0.3)
  Top 0.178: v36.89,23.16 38.71,24.98 38.71,27.45 v37.88,28.28
  Bottom 0.178: v36.89,23.16 36.89,21.02 LED8.2-DOUT | v37.88,28.28 37.06,28.28 36.07,29.27 36.07,31.09 39.37,34.39 39.37,37.69 39.86,38.19 LED9.4-DIN
N$9
  Bottom 0.178: LED9.2-DOUT 36.89,33.4 36.89,36.04 37.88,37.03 37.88,41.49 38.21,41.82 38.21,47.43 39.2,48.42 39.2,50.07 39.86,50.73 LED10.4-DIN
N$10
  Bottom 0.178: LED10.2-DOUT 36.89,46.11 36.89,48.92 39.2,51.23 39.2,51.72 42.18,54.7 49.94,54.7 52.74,57.5 58.19,57.5 61.99,61.3 62.32,61.3 62.65,61.63 62.65,62.46 62.15,62.95 55.88,62.95 55.71,62.79 LED11.4-DIN
N$11
  Bottom 0.178: LED12.4-DIN 42.67,59.32 45.31,59.32 47.46,61.46 61.16,61.46 61.49,61.8 LED11.2-DOUT
N$12
  Bottom 0.178: LED13.4-DIN 29.3,59.98 33.26,59.98 33.43,60.14 39.53,60.14 42.84,56.84 47.95,56.84 LED12.2-DOUT
N$13
  Bottom 0.178: LED14.4-DIN 16.75,64.77 22.36,64.77 29.46,57.67 31.77,57.67 33.43,56.02 LED13.2-DOUT
NEOPIXEL-SIGNAL  (via drill 0.3)
  Top 0.178: v30.29,2.03 30.29,6.65 31.94,8.3 33.92,8.3 v34.25,8.63 | v49.11,55.36 44.82,55.36 44.49,55.03 P1.9
  Bottom 0.178: v30.29,2.03 57.2,2.03 59.68,4.51 67.27,4.51 67.6,4.84 68.43,4.84 73.21,9.62 74.7,9.62 LED1.4-DIN | v34.25,8.63 34.25,46.77 38.87,51.39 38.87,51.89 42.01,55.03 48.78,55.03 v49.11,55.36
S0  (via drill 0.3)
  Top 0.178: v35.9,44.29 36.73,44.29 38.71,42.31 38.71,41.65 40.52,39.84 40.52,38.35 U$1.10 | v35.74,47.43 35.74,50.24 34.25,51.72 34.25,54.53 33.92,54.86 P1.2
  Bottom 0.178: v35.9,44.29 35.9,47.27 v35.74,47.43
S1  (via drill 0.3)
  Top 0.178: v41.35,41.49 41.35,38.35 U$1.11 | v41.35,43.14 41.35,43.63 42.51,44.79 42.51,49.08 40.52,51.06 40.52,56.68 v40.69,56.84 | v35.41,57.01 35.41,55.03 P1.3
  Bottom 0.178: v41.35,43.14 v41.35,41.49 | v40.69,56.84 40.69,57.67 40.03,58.33 36.73,58.33 v35.41,57.01
S2
  Top 0.178: U$1.14 41.19,45.62 41.19,46.28 39.37,48.09 38.38,48.09 37.72,48.75 37.72,52.71 36.89,53.54 36.89,54.86 P1.4
S3  (via drill 0.3)
  Top 0.178: v41.85,48.92 41.85,45.62 U$1.13 | v41.85,52.38 41.85,53.38 42.01,53.54 42.01,56.51 v41.68,56.84 | v38.05,53.21 38.05,54.53 38.38,54.86 P1.5
  Bottom 0.178: v41.85,48.92 41.85,49.74 42.51,50.4 42.51,51.72 v41.85,52.38 | v38.05,53.21 v41.68,56.84

### Text on the board
tPlace: JLCJLCJLCJLC